# EasyEDA Pro project ChisFlash-MBC5_GBC烧录卡_shn修改plus图纸nds烧录线路+电池加固通孔.epro, board ChisFlash-MBC5-Plus-v1.1
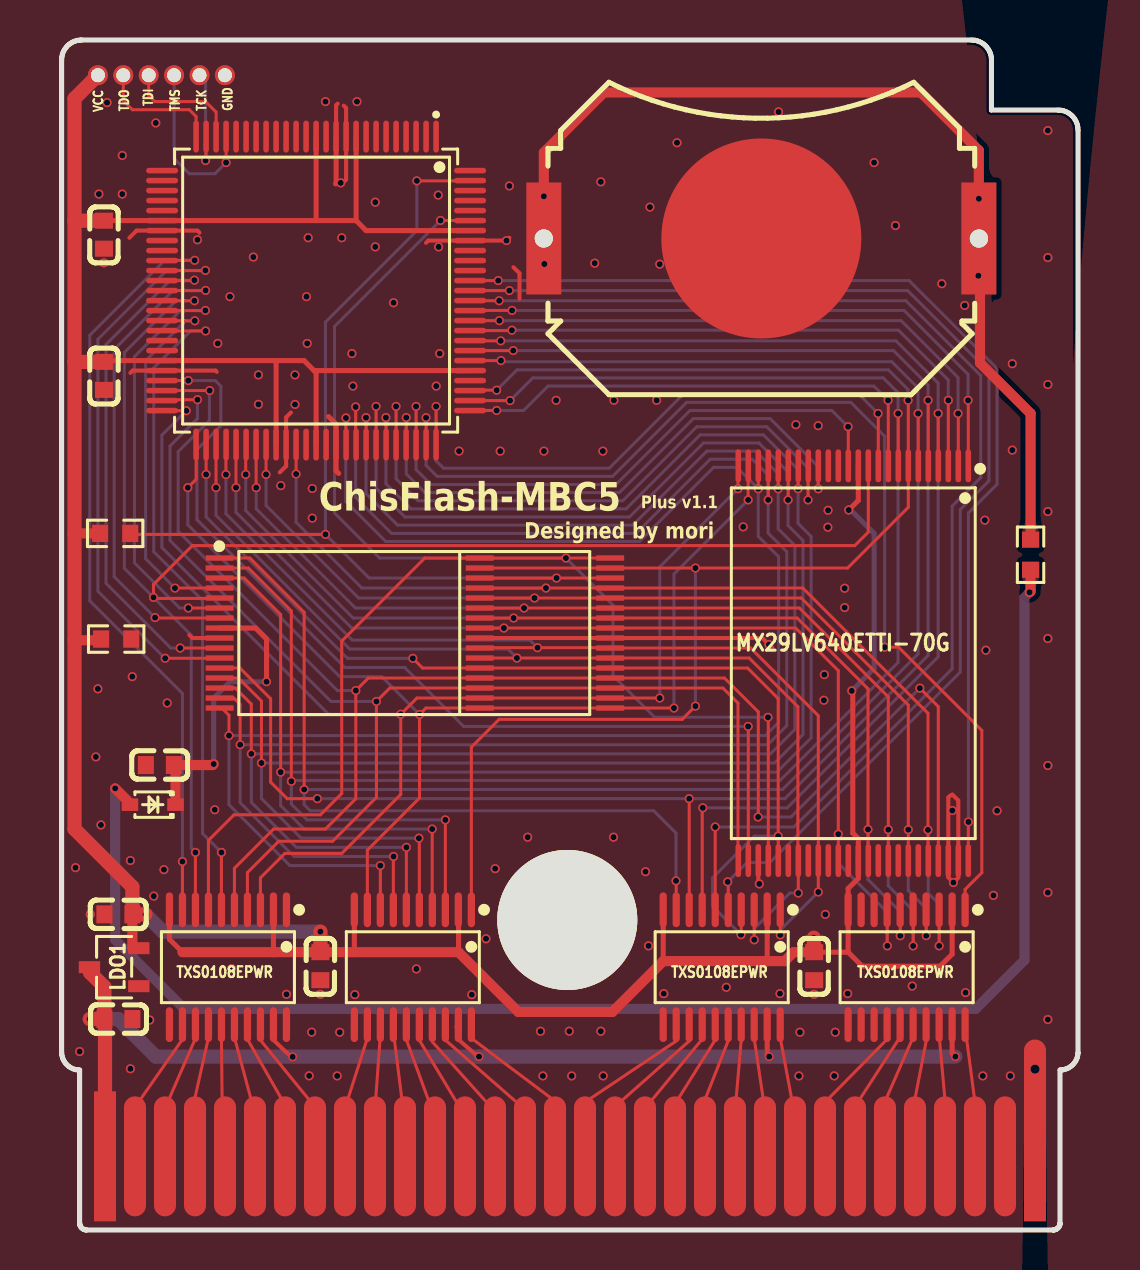
[diagram p4: board, top side]
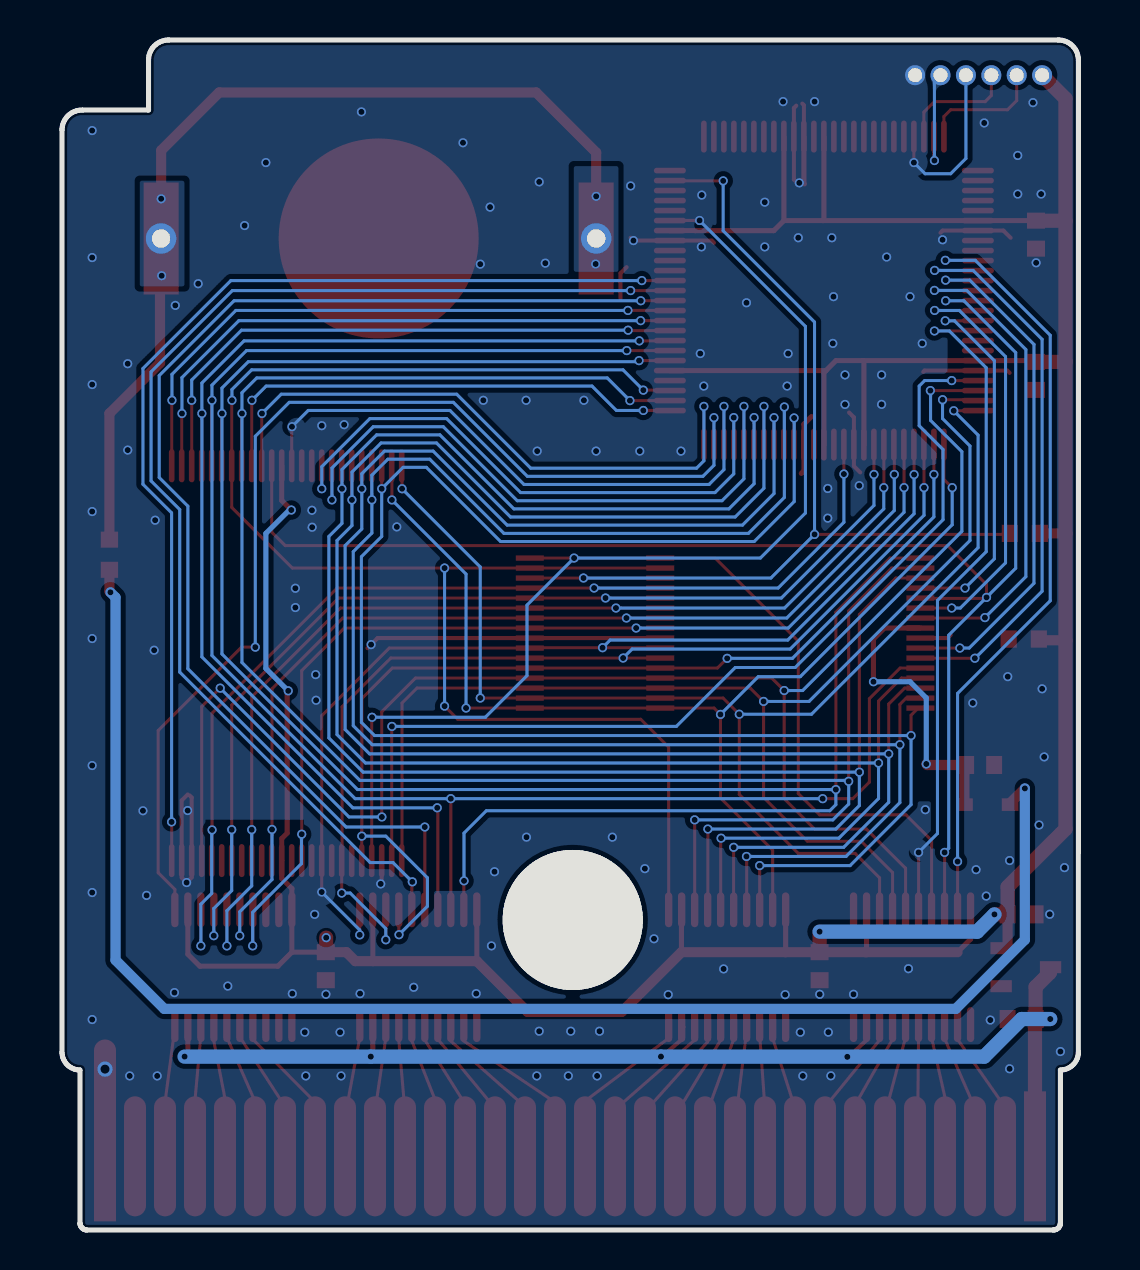
[diagram p5: board, bottom side, seen from below]

Outline 50.82 x 59.5 mm; copper layers: Top Layer, Bottom Layer. Coordinates in mm from the lower left corner of the outline.
Stack: Top Layer 0.035mm / Dielectric1 1.51mm FR4 er 4.5 / Bottom Layer 0.035mm

## Design rules (mm)
template: 自定义配置
spacing copperThickness1oz (default): track to track 0.254, other pairs 0.152 to 0.152
spacing copperThickness2oz: track to track 0.203, other pairs 0.152 to 0.3
track width copperThickness1oz (default): min 0.152, default 0.152, max 2.54
track width copperThickness2oz: min 0.203, default 0.254, max 2.54
differential pair differentialPair (default): width min 0.127, default 0.254, max 2.54; gap min 0.152, default 0.152
via viaSize (default): diameter min 0.457, default 0.457, max 10; hole min 0.3, default 0.305, max 6.299

## Placement (name value [footprint] x y rotation side)
BT1  MY-2016-02  [BAT-SMD_MY-2032-08]  34.99 49.58 180 top
C1  100nF  [C0603]  4.91 23.25 0 top
C3  100nF  [C0603]  2.12 49.77 90 top
C4  100nF  [C0603]  2.12 42.71 90 top
C5  10uF  [C0603]  2.84 10.55 180 top
C6  10uF  [C0603]  2.84 15.78 0 top
C7  100nF  [C0603]  12.94 13.19 90 top
C10  100nF  [C0603]  37.63 13.19 90 top
D1  RB751V-40  [SOD-323_L1.7-W1.3-LS2.6-RD-1]  4.56 21.27 180 top
J1  GAMEBOY-CARTRIDGE-MBC3  [GAMEBOY_CARTRIDGE_PIN]  25.28 15.5 0 top
LDO1  ME6209A33M3G  [SOT-23-3_L2.9-W1.6-P1.90-LS2.8-BR]  2.63 13.14 0 top
NOREF  -  [Pad_e0]  45.87 49.58 0 top
NOREF#2  -  [Pad_e2]  24.11 49.58 0 top
NOREF#3  -  [Pad_e20]  24.11 49.58 0 top
R1  10kΩ  [R0603]  48.45 33.77 270 top
R2  100kΩ  [R0603]  2.73 29.55 0 top
R3  10kΩ  [R0603]  2.68 34.83 180 top
U1  MX29LV640ETTI-70GTR  [TSOP-48_L12.0-W18.4-P0.50-LS20.0-BL]  39.58 28.34 180 top
U2  SRAM&FRAM  [TSSOP-TSOP二合一]  18.67 29.83 180 top
U3  EPM240T100C5N  [TQFP-100_L14.0-W14.0-P0.50-LS16.0-BL]  12.72 46.97 180 top
U7  TXS0108EPWR  [TSSOP-20_L6.5-W4.4-P0.65-LS6.4-BL]  8.32 13.14 180 top
U8  TXS0108EPWR  [TSSOP-20_L6.5-W4.4-P0.65-LS6.4-BL]  17.56 13.14 180 top
U9  TXS0108EPWR  [TSSOP-20_L6.5-W4.4-P0.65-LS6.4-BL]  33.01 13.14 180 top
U10  TXS0108EPWR  [TSSOP-20_L6.5-W4.4-P0.65-LS6.4-BL]  42.25 13.14 180 top
XP1  JTAG  [HDR-TH_6P-P1.27-V-M-1]  4.99 57.74 0 top

## Footprints (pads in the part's own frame, mm; a bottom-side part is the same pattern mirrored in y, then rotated)
BAT-SMD_MY-2032-08
  rect 1.75x5.6 smd: 1(-10.875,0) 1(10.875,0)
  round 10 smd: 2(0,0)
C0603
  rect 0.8x0.9 smd: 1(-0.7,0) 2(0.7,0)
GAMEBOY_CARTRIDGE_PIN
  round 7 hole 7: 0(0,0)
  rect 1.1x6.5 smd: 1(-23.114,-11.819) 32(23.386,-11.819)
  oval 1.1x6 smd: 2(-21.614,-11.819) 3(-20.114,-11.819) 4(-18.614,-11.819) 5(-17.114,-11.819) 6(-15.614,-11.819) 7(-14.114,-11.819) 8(-12.614,-11.819) 9(-11.114,-11.819) 10(-9.614,-11.819) 11(-8.114,-11.819) 12(-6.614,-11.819) 13(-5.114,-11.819) 14(-3.614,-11.819) 15(-2.114,-11.819) 16(-0.614,-11.819) 17(0.886,-11.819) 18(2.386,-11.819) 19(3.886,-11.819) 20(5.386,-11.819) 21(6.886,-11.819) 22(8.386,-11.819) 23(9.886,-11.819) 24(11.386,-11.819) 25(12.886,-11.819) 26(14.386,-11.819) 27(15.886,-11.819) 28(17.386,-11.819) 29(18.886,-11.819) 30(20.386,-11.819) 31(21.886,-11.819)
HDR-TH_6P-P1.27-V-M-1
  round 1 hole 0.7: 1(-3.175,0) 2(-1.905,0) 3(-0.635,0) 4(0.635,0) 5(1.905,0) 6(3.175,0)
Pad_e0
  round 1.524 hole 0.914: 1(0,0)
Pad_e2
  round 1.524 smd: 2(0,0)
Pad_e20
  round 1.524 hole 0.914: 1(0,0)
R0603
  rect 0.806x0.864 smd: 1(-0.753,0) 2(0.753,0)
SOD-323_L1.7-W1.3-LS2.6-RD-1
  rect 0.83x0.63 smd: 1(-1.14,0) 2(1.14,0)
SOT-23-3_L2.9-W1.6-P1.90-LS2.8-BR
  rect 1.07x0.6 smd: 1(1.235,-0.95) 2(1.235,0.95) 3(-1.235,0)
TQFP-100_L14.0-W14.0-P0.50-LS16.0-BL
  oval 0.28x1.6 smd: 1(-6,-7.7) 2(-5.5,-7.7) 3(-5,-7.7) 4(-4.5,-7.7) 5(-4,-7.7) 6(-3.5,-7.7) 7(-3,-7.7) 8(-2.5,-7.7) 9(-2,-7.7) 10(-1.5,-7.7) 11(-1,-7.7) 12(-0.5,-7.7) 13(0,-7.7) 14(0.5,-7.7) 15(1,-7.7) 16(1.5,-7.7) 17(2,-7.7) 18(2.5,-7.7) 19(3,-7.7) 20(3.5,-7.7) 21(4,-7.7) 22(4.5,-7.7) 23(5,-7.7) 24(5.5,-7.7) 25(6,-7.7) 51(6,7.7) 52(5.5,7.7) 53(5,7.7) 54(4.5,7.7) 55(4,7.7) 56(3.5,7.7) 57(3,7.7) 58(2.5,7.7) 59(2,7.7) 60(1.5,7.7) 61(1,7.7) 62(0.5,7.7) 63(0,7.7) 64(-0.5,7.7) 65(-1,7.7) 66(-1.5,7.7) 67(-2,7.7) 68(-2.5,7.7) 69(-3,7.7) 70(-3.5,7.7) 71(-4,7.7) 72(-4.5,7.7) 73(-5,7.7) 74(-5.5,7.7) 75(-6,7.7)
  oval 1.6x0.28 smd: 26(7.7,-6) 27(7.7,-5.5) 28(7.7,-5) 29(7.7,-4.5) 30(7.7,-4) 31(7.7,-3.5) 32(7.7,-3) 33(7.7,-2.5) 34(7.7,-2) 35(7.7,-1.5) 36(7.7,-1) 37(7.7,-0.5) 38(7.7,0) 39(7.7,0.5) 40(7.7,1) 41(7.7,1.5) 42(7.7,2) 43(7.7,2.5) 44(7.7,3) 45(7.7,3.5) 46(7.7,4) 47(7.7,4.5) 48(7.7,5) 49(7.7,5.5) 50(7.7,6) 76(-7.7,6) 77(-7.7,5.5) 78(-7.7,5) 79(-7.7,4.5) 80(-7.7,4) 81(-7.7,3.5) 82(-7.7,3) 83(-7.7,2.5) 84(-7.7,2) 85(-7.7,1.5) 86(-7.7,1) 87(-7.7,0.5) 88(-7.7,0) 89(-7.7,-0.5) 90(-7.7,-1) 91(-7.7,-1.5) 92(-7.7,-2) 93(-7.7,-2.5) 94(-7.7,-3) 95(-7.7,-3.5) 96(-7.7,-4) 97(-7.7,-4.5) 98(-7.7,-5) 99(-7.7,-5.5) 100(-7.7,-6)
TSOP-48_L12.0-W18.4-P0.50-LS20.0-BL
  oval 0.28x1.65 smd: 1(-5.75,-9.87) 2(-5.25,-9.87) 3(-4.75,-9.87) 4(-4.25,-9.87) 5(-3.75,-9.87) 6(-3.25,-9.87) 7(-2.75,-9.87) 8(-2.25,-9.87) 9(-1.75,-9.87) 10(-1.25,-9.87) 11(-0.75,-9.87) 12(-0.25,-9.87) 13(0.25,-9.87) 14(0.75,-9.87) 15(1.25,-9.87) 16(1.75,-9.87) 17(2.25,-9.87) 18(2.75,-9.87) 19(3.25,-9.87) 20(3.75,-9.87) 21(4.25,-9.87) 22(4.75,-9.87) 23(5.25,-9.87) 24(5.75,-9.87) 25(5.75,9.87) 26(5.25,9.87) 27(4.75,9.87) 28(4.25,9.87) 29(3.75,9.87) 30(3.25,9.87) 31(2.75,9.87) 32(2.25,9.87) 33(1.75,9.87) 34(1.25,9.87) 35(0.75,9.87) 36(0.25,9.87) 37(-0.25,9.87) 38(-0.75,9.87) 39(-1.25,9.87) 40(-1.75,9.87) 41(-2.25,9.87) 42(-2.75,9.87) 43(-3.25,9.87) 44(-3.75,9.87) 45(-4.25,9.87) 46(-4.75,9.87) 47(-5.25,9.87) 48(-5.75,9.87)
TSSOP-20_L6.5-W4.4-P0.65-LS6.4-BL
  oval 0.364x1.742 smd: 1(-2.925,-2.871) 2(-2.275,-2.871) 3(-1.625,-2.871) 4(-0.975,-2.871) 5(-0.325,-2.871) 6(0.325,-2.871) 7(0.975,-2.871) 8(1.625,-2.871) 9(2.275,-2.871) 10(2.925,-2.871) 11(2.925,2.871) 12(2.275,2.871) 13(1.625,2.871) 14(0.975,2.871) 15(0.325,2.871) 16(-0.325,2.871) 17(-0.975,2.871) 18(-1.625,2.871) 19(-2.275,2.871) 20(-2.925,2.871)
TSSOP-TSOP二合一
  rect 1.399x0.27 smd: 1(10.762,-3.769) 2(10.762,-3.269) 3(10.762,-2.769) 4(10.762,-2.269) 5(10.762,-1.769) 6(10.762,-1.269) 7(10.762,-0.769) 8(10.762,-0.269) 9(10.762,0.231) 10(10.762,0.731) 11(10.762,1.231) 12(10.762,1.731) 13(10.762,2.231) 14(10.762,2.731) 15(10.762,3.231) 16(10.762,3.731) 17(-8.763,3.731) 17(-2.243,3.731) 18(-8.763,3.231) 18(-2.243,3.231) 19(-8.763,2.731) 19(-2.243,2.731) 20(-8.763,2.231) 20(-2.243,2.231) 21(-8.763,1.731) 21(-2.243,1.731) 22(-8.763,1.231) 22(-2.243,1.231) 23(-8.763,0.731) 23(-2.243,0.731) 24(-8.763,0.231) 24(-2.243,0.231) 25(-8.763,-0.269) 25(-2.243,-0.269) 26(-8.763,-0.769) 26(-2.243,-0.769) 27(-8.763,-1.269) 27(-2.243,-1.269) 28(-8.763,-1.769) 28(-2.243,-1.769) 29(-8.763,-2.269) 29(-2.243,-2.269) 30(-8.763,-2.769) 30(-2.243,-2.769) 31(-8.763,-3.269) 31(-2.243,-3.269) 32(-8.763,-3.769) 32(-2.243,-3.769)

## Nets
As in the schematic, except:
BAT+: BT1.1 NOREF.1 NOREF#2.2 NOREF#3.1 R1.1

Pads without a net: J1 0 31; U1 14 15 30 32 34 36 39 41 43; U3 1 2 3 4 5 6 7 8 12 14 15 16 17 18 19 20 21 26 27 28 29 30 33 34 43 44 62 64 90 91 92 96 97 98 100; U7 1 20; U10 8 9 12 13

## Via types
v1: diameter 0.457, hole 0.305, Top Layer to Bottom Layer, 281 vias
v2: diameter 0.762, hole 0.457, Top Layer to Bottom Layer, 1 via
v3: diameter 0.508, hole 0.305, Top Layer to Bottom Layer, 2 vias

## Routing (per net, layer and track width the routed paths; a pad name or vN(x,y) marks a point on that pad's centre or on a via; arc(x,y) is an arc through that point)
+3V3: length 199.6
  Top Layer w0.254: 6.04,13.89 5.39,14.54 U7.10 ; U3.63 12.72,42.87 12.62,42.97 ; C3.2 2.13,50.47 U3.31 12.76,50.47 ; 12.62,42.97 U3.80 ; 12.62,42.97 12.12,43.47 10.76,43.47 ; 10.62,13.89 10.59,13.92 U7.2 ; 10.76,43.47 10.72,43.43 U3.59 ; 10.76,43.47 U3.45 2.19,43.47 C4.2 ; U8.2 19.85,16 19.85,13.89 ; 30.08,13.45 U9.10 ; U3.94 19.16,49.97 19.15,49.97 15.23,49.97 14.72,50.47 ; 12.76,50.47 12.72,50.51 U3.13 ; 12.76,50.47 14.72,50.47 ; U3.9 14.72,50.47 ; v1(39.51,26.96) 39.56,26.91 39.56,19.85 39.83,19.57 U1.37 39.83,17.58 39.33,17.07 U10.10 39.33,13.89 ; C10.2 39.33,13.89 ; 39.33,13.89 40.03,13.19 43.93,13.19 44.53,13.79 U10.2 ; 14.64,13.89 U8.10 ; U1.12 39.83,36.48 v1(39.36,36) ; U9.2 35.28,13.45
  Top Layer w0.508: LDO1.2 3.54,14.09 C6.2 ; R3.2 0.65,34.83 ; C10.2 36.6,13.89 36.16,13.45 30.08,13.45 27.54,10.91 22.83,10.91 19.85,13.89 C7.2 6.04,13.89 ; 1.91,29.49 0.65,29.49
  Top Layer w0.711: 0.65,50.45 0.66,50.47 C3.2 ; 0.65,50.45 0.65,56.57 XP1.1 ; 0.65,50.45 0.65,43.42 ; C4.2 0.66,43.41 0.65,43.42 ; v3(4.2,15.78) C6.2 3.54,17.16 0.65,20.05 0.65,43.42 ; v1(37.61,14.62) 37.61,13.91 C10.2 ; C7.2 v1(12.94,14.92)
  Bottom Layer w0.254: v1(39.36,36) 39.46,36 40.63,34.83 40.63,28.08 v1(39.51,26.96)
  Bottom Layer w0.711: v1(12.94,14.92) 5.06,14.92 v3(4.2,15.78)
+5V: length 61.2
  Top Layer w0.203: 11.51,8.62 10.58,9.51 ; U8.19 19.83,10.27 19.75,10.16 19.86,9.5 20.69,8.78 20.76,8.78 v1(20.87,8.67)
  Top Layer w0.254: v1(44.69,8.67) 44.53,8.83 U10.19 ; v1(35.38,8.67) 35.28,8.77 U9.19
  Top Layer w0.711: 1.4,13.05 1.43,13.02 1.43,12.87 2.14,12.15 C5.2 v3(1.41,10.55) ; J1.1 2.17,10.52
  Bottom Layer w0.711: v3(1.41,10.55) 2.83,10.55 4.71,8.67 v1(20.87,8.67) v1(35.38,8.67) v1(44.69,8.67)
  vias: v1(11.55,8.66)
GND: length 60.4
  Top Layer w0.203: 10.91,37.88 11.22,38.2 U3.60 11.22,40.64 11.47,40.88 ; 6.89,49.87 6.79,49.97 U3.32 3.75,49.97 3.39,49.61 ; 13.8,56.32 13.72,56.24 U3.11 ; U2.9 6.54,29.6 6.39,29.75 ; U1.27 34.83,17.36 v1(34.88,17.31) ; 7.76,42.91 7.69,42.97 U3.46 3.55,42.97 3.44,42.86 ; U2.24 35.04,29.6 v1(35.37,29.27) 35.55,29.09 ; 44.44,21.73 44.33,21.62 U1.46 44.33,17.63 v1(44.59,17.37) 44.83,17.62 U1.47 44.83,21.48 44.54,21.78 ; 14.06,52.36 14.22,52.53 U3.10 14.22,56.1 14.11,56.22 ; 22.59,48.14 22.9,47.84 22.9,46.57 ; 22.39,49.61 v1(22.25,49.47) U3.93 18.34,49.47 18.22,49.36
  Top Layer w0.254: 13.35,40.67 13.72,40.29 U3.65 13.72,37.96 13.85,37.83 ; U3.11 13.72,52.33 13.7,52.31
  Top Layer w1.1: 48.67,8.97 v2(48.67,8.04) J1.32
  vias: v1(0.7,18.12) v1(0.9,8.92) v1(1.43,15.79) v1(1.71,23.66) v1(1.81,27.06) v1(1.86,51.8) v1(1.97,20.25) v1(2.11,48.36) v1(2.27,56.37) v1(3.03,53.73) v1(3.03,51.8) v1(3.53,27.67) v1(3.44,18.47) v1(3.44,8.06) v1(4.41,10.5) v1(4.61,16.7) v1(4.71,55.36) v1(5.12,18.02) v1(5.28,26.35) v1(6.79,49.51) v1(7.66,21.01) v1(7.81,44.33) v1(8.42,46.67) v1(8.5,13.07) v1(9.59,48.65) v1(9.84,42.76) v1(9.84,41.28) v1(10.96,37.22) v1(11.25,11.79) v1(11.67,42.76) v1(11.67,41.28) v1(12.33,49.61) v1(12.25,46.67) v1(12.28,44.33) v1(12.38,7.71) v1(12.53,37.08) v1(12.53,35.59) v1(12.5,9.89) v1(12.93,11.79) v1(13.19,56.42) v1(13.78,7.7) v1(13.91,9.89) v1(13.96,52.36) v1(14.01,49.61) v1(14.51,43.82) v1(14.56,42.2) v1(14.66,11.77) v1(14.77,56.42) v1(15.68,51.39) v1(15.68,49.16) v1(16.6,46.36) v1(17.74,13.05) v1(18.73,42.2) v1(18.83,51.75) v1(18.85,49.16) v1(18.91,43.82) v1(19.87,38.95) v1(20.51,11.77) v1(21.22,14.56) v1(21.68,18.07) v1(21.93,38.95) v1(22.39,52.21) v1(23.3,19.64) v1(23.94,9.94) v1(24.12,38.95) v1(24.06,7.7) v1(24.72,41.49) v1(25.38,9.94) v1(25.5,7.7) v1(26.66,48.34) v1(26.96,52.41) v1(26.96,9.94) v1(27.06,38.95) v1(27.08,7.7) v1(27.62,41.49) v1(27.6,19.64) v1(29.2,17.92) v1(29.42,51.15) v1(29.35,14.21) v1(29.75,41.49) v1(29.91,48.29) v1(30.11,11.82) v1(30.77,54.37) v1(33.23,12.14) v1(34.08,35.16) v1(35.85,55.91) v1(35.92,11.82) v1(36.71,40.27) v1(36.92,9.89) v1(36.87,7.7) v1(37.62,11.79) v1(37.83,40.22) v1(38.12,26.49) v1(38.14,27.77) v1(38.19,15.78) v1(38.32,35.99) v1(38.31,35.14) v1(38.63,7.7) v1(38.68,9.89) v1(39.15,32.09) v1(39.15,31.12) v1(39.3,11.82) v1(40.63,53.37) v1(41.69,50.22) v1(42.53,12.2) v1(44.01,47.32) v1(44.54,20.97) v1(45.16,46.23) v1(45.2,11.87) v1(46.06,7.7) v1(46.16,35.49) v1(46.21,28.99) v1(46.59,16.73) v1(46.77,20.96) v1(47.44,7.7) v1(47.53,43.32) v1(47.53,39) v1(49.31,54.97) v1(49.31,48.62) v1(49.31,42.27) v1(49.31,35.92) v1(49.31,29.57) v1(49.31,23.22) v1(49.31,16.87) v1(49.31,10.52)
A0: length 83.3
  Top Layer w0.152: v1(42.91,27.1) 43.83,26.17 43.83,18.64 ; U3.48 v1(7.4,41.97) ; v1(34.83,20.65) 34.83,20.66 34.83,25.91 33.14,27.6 15.34,27.6 v1(14.71,26.98) 14.71,21.57 13.19,20.05 10.6,20.05 8.64,18.09 U7.5
  Bottom Layer w0.152: v1(34.83,20.65) 36.47,20.65 v1(42.91,27.1) ; v1(14.71,26.98) 13.79,26.98 5.83,34.93 5.83,38.92 7.39,40.48 7.39,42.06
A0_EXT: length 3.7
  Top Layer w0.152: 9.62,5.99 8.65,9.61
A1: length 64.1
  Top Layer w0.152: v1(6.79,41.52) 5.07,41.52 U3.49 ; U7.4 9.29,17.87 10.86,19.44 13.55,19.44 15.74,21.63 v1(15.74,26.43) 16.41,27.1 33.07,27.1 33.82,26.35 33.82,18.65 33.83,18.64
  Bottom Layer w0.152: v1(6.79,41.52) 6.79,40.57 5.42,39.2 5.42,34.48 13.47,26.43 v1(15.74,26.43)
A1_EXT: length 3.9
  Top Layer w0.152: 11.2,6.19 9.29,9.54
A2: length 65
  Top Layer w0.152: v1(33.82,37.06) 33.82,38.36 33.83,38.38 ; v1(6.23,40.97) 5.03,40.97 U3.50 ; U7.3 9.94,17.61 11.16,18.83 14.01,18.83 16.96,21.78 v1(16.96,25.79) 17.77,26.6 v1(29.91,26.6)
  Bottom Layer w0.152: v1(16.96,25.79) 13.35,25.79 5.01,34.12 5.01,39.75 v1(6.23,40.97) ; v1(33.82,37.06) 29.91,33.15 v1(29.91,26.6)
A2_EXT: length 4.4
  Top Layer w0.152: 12.68,6.14 9.92,9.52
A3: length 57.2
  Top Layer w0.152: 34.33,38.38 34.33,38.37 v1(34.33,36.51) ; v1(30.62,26.1) 18.22,26.1 v1(17.9,25.78) 17.9,21.6 15.29,18.99 U8.9 ; v1(6.31,37.12) 6.72,37.53 U3.51
  Bottom Layer w0.152: v1(6.31,37.12) 6.31,35.26 13.91,27.67 16.01,27.67 v1(17.9,25.78) ; v1(34.33,36.51) 30.62,32.8 v1(30.62,26.1)
A3_EXT: length 3.3
  Top Layer w0.152: 14.24,6.3 15.25,9.48
A4: length 86.1
  Top Layer w0.152: v1(14.22,40.6) 14.22,39.28 U3.66 ; v1(34.83,37.06) 34.83,38.38 ; 8.01,26.1 8.37,25.74 v1(8.37,24.72) ; v1(15.94,18.22) U8.8
  Bottom Layer w0.152: v1(14.22,40.6) 14.21,40.6 14.21,36.43 16.21,34.43 28.89,34.43 32.6,38.13 33.76,38.13 v1(34.83,37.06) 34.83,34.68 35.85,33.66 35.85,25.38 35.19,24.72 v1(8.37,24.72) 8.37,21.27 11.42,18.22 v1(15.94,18.22)
A4_EXT: length 3.6
  Top Layer w0.152: 15.66,5.97 15.92,9.56
A5: length 89.7
  Top Layer w0.152: v1(8.93,24.27) 8.93,26.28 8.61,26.6 U2.15 ; v1(35.33,36.51) 35.33,36.52 35.33,38.38 ; U3.67 14.7,39.3 v1(14.7,41.15) ; v1(16.6,18.68) 16.59,18.67 U8.7
  Bottom Layer w0.152: v1(14.7,41.15) 14.7,36.63 16.5,34.83 28.72,34.83 32.43,38.54 34.53,38.54 35.33,37.74 v1(35.33,36.51) 35.33,34.85 36.26,33.92 36.26,25.22 35.31,24.27 v1(8.93,24.27) 8.93,21.37 11.62,18.68 v1(16.6,18.68)
A5_EXT: length 3.9
  Top Layer w0.152: 17.12,5.66 16.64,9.54
A6: length 89.6
  Top Layer w0.152: v1(9.48,23.81) 9.48,26.3 8.68,27.1 7.5,27.1 ; 35.83,38.38 35.83,37.07 v1(35.83,37.06) ; U8.6 17.24,16.01 v1(17.24,19.13) ; v1(15.22,40.62) 15.22,40.61 U3.68
  Bottom Layer w0.152: v1(17.24,19.13) 11.74,19.13 9.48,21.39 v1(9.48,23.81) 35.44,23.81 36.66,25.03 36.66,34.22 35.83,35.06 v1(35.83,37.06) 35.83,37.81 34.7,38.95 32.26,38.95 28.56,35.25 16.8,35.25 15.22,36.82 v1(15.22,40.62)
A6_EXT: length 3.4
  Top Layer w0.152: 17.22,9.57 18.38,6.38
A7: length 92.4
  Top Layer w0.152: 7.5,27.6 8.84,27.6 9.99,26.45 v1(9.99,23.35) ; v1(17.87,19.59) 17.89,19.57 U8.5 ; 36.33,38.38 36.33,36.52 v1(36.32,36.51) ; 15.72,41.18 U3.69
  Bottom Layer w0.152: v1(15.72,41.18) 15.72,37.09 17.16,35.65 28.39,35.65 32.09,39.35 34.87,39.35 36.32,37.9 v1(36.32,36.51) 36.32,35.22 37.07,34.48 37.07,24.77 35.65,23.35 v1(9.99,23.35) 9.99,21.57 11.97,19.59 v1(17.87,19.59)
A7_EXT: length 4
  Top Layer w0.152: 17.92,9.57 17.9,9.48 19.83,6.26 19.93,6.23
A8: length 95.6
  Top Layer w0.152: 36.83,38.38 36.82,38.37 v1(36.82,37.06) ; v1(10.95,22.89) 10.95,30.77 9.13,32.6 8.06,32.6 ; v1(18.53,20.05) 18.53,16.02 U8.4 ; v1(16.22,40.62) 16.22,40.61 U3.70
  Bottom Layer w0.152: v1(16.22,40.62) 16.22,37.32 17.47,36.06 28.23,36.06 31.93,39.76 35.09,39.76 36.82,38.03 v1(36.82,37.06) 36.82,35.33 37.48,34.68 37.48,24.61 35.76,22.89 v1(10.95,22.89) 10.95,21.22 12.13,20.05 v1(18.53,20.05)
A8_EXT: length 4.5
  Top Layer w0.152: 18.55,9.55 18.54,9.4 21.32,6.31 21.47,6.3
A9: length 97.4
  Top Layer w0.152: v1(41.82,40.83) 41.83,40.82 41.83,38.38 ; v1(22.42,41.47) 20.43,41.47 ; v1(19.19,20.51) U8.3 ; 8.06,33.1 9.34,33.1 11.49,30.95 v1(11.49,22.44)
  Bottom Layer w0.152: v1(22.42,41.47) 23.56,42.6 41.08,42.6 41.82,41.86 v1(41.82,40.83) 41.82,28.38 35.93,22.48 11.53,22.48 v1(11.49,22.44) 11.49,21.3 12.28,20.51 v1(19.19,20.51)
A9_EXT: length 4.9
  Top Layer w0.152: 19.23,9.54 19.23,9.46 22.81,6.33 22.9,6.34
A10: length 78.3
  Top Layer w0.152: v1(31.69,26.2) 31.03,25.54 21.88,25.54 20.49,24.14 U8.1 ; 21.06,33.1 v1(31.69,33.1) 39.3,33.1 42.33,36.13 U1.7 42.33,41.48 v1(42.32,41.49) ; U3.78 20.45,41.99 v1(21.75,41.99)
  Bottom Layer w0.152: v1(31.69,33.1) v1(31.69,26.2) ; v1(42.32,41.49) 42.32,42.02 41.34,43.01 22.77,43.01 v1(21.75,41.99)
A10_EXT: length 5.1
  Top Layer w0.152: 20.55,9.54 24.63,6.47
A11: length 110.1
  Top Layer w0.152: v1(42.82,40.83) 42.83,40.82 42.83,38.38 ; v1(30.72,17.46) 30.73,17.45 U9.9 ; v1(21.97,43.47) 20.43,43.47 U3.81 ; 8.06,33.6 9.41,33.6 12.13,30.89 v1(12.13,22.02)
  Bottom Layer w0.152: v1(21.97,43.47) 22.02,43.42 41.5,43.42 42.82,42.1 v1(42.82,40.83) 42.82,28.8 36.04,22.02 v1(12.13,22.02) 12.13,21.27 12.43,20.96 29.6,20.96 30.72,19.85 v1(30.72,17.46)
A11_EXT: length 5.3
  Top Layer w0.152: 26.37,6.53 30.75,9.46
A12: length 89.2
  Top Layer w0.152: 8,28.1 8.92,28.1 10.45,26.57 10.45,22.4 11.28,21.57 v1(12.79,21.57) ; v1(31.38,21.57) U9.8 ; v1(22.58,43.97) 20.43,43.97 ; 43.33,38.38 43.33,41.48 v1(43.32,41.49)
  Bottom Layer w0.152: v1(22.58,43.97) 41.59,43.97 43.32,42.24 v1(43.32,41.49) 43.32,28.73 36.16,21.57 v1(31.38,21.57) v1(12.79,21.57)
A12_EXT: length 4.5
  Top Layer w0.152: 31.4,9.47 28.01,6.47
A13: length 60.4
  Top Layer w0.152: v1(21.96,44.46) 20.44,44.46 U3.83 ; v1(32.06,21.11) 32.03,21.08 U9.7 ; v1(43.83,40.83) 43.83,38.39 43.83,38.38
  Bottom Layer w0.152: v1(32.06,21.11) 36.28,21.11 43.83,28.66 v1(43.83,40.83) 43.83,42.35 41.72,44.46 v1(21.96,44.46)
A13_EXT: length 4.1
  Top Layer w0.152: 32.07,9.6 29.49,6.47
A14: length 61.6
  Top Layer w0.152: v1(21.88,46.47) 20.43,46.47 U3.87 ; U9.6 v1(32.68,20.15)
  Bottom Layer w0.152: v1(21.88,46.47) 42.22,46.47 45.96,42.72 45.96,37.63 44.53,36.19 44.53,28.07 36.61,20.15 v1(32.68,20.15)
A14_EXT: length 3.6
  Top Layer w0.152: 32.71,9.55 30.8,6.51
A15: length 60.6
  Top Layer w0.152: v1(33.3,17.41) 33.33,17.38 U9.5 ; U3.88 v1(22.39,46.97)
  Bottom Layer w0.152: v1(33.3,17.41) 34.27,18.37 35.41,18.37 44.93,27.9 44.93,36.03 46.37,37.46 46.37,42.91 42.3,46.97 v1(22.39,46.97)
A15_EXT: length 3.3
  Top Layer w0.152: 33.35,9.51 32.15,6.48
BAT+: length 48.4
  Top Layer w0.508: R1.1 48.45,40.83 45.92,43.36 45.92,49.01 ; BT1.1 v1(45.86,51.56) 45.86,53.98 42.96,56.88 27.11,56.88 24.11,53.88 v1(24.11,51.69) BT1.1
  vias: v1(24.14,48.3) v1(45.84,47.72)
BATQ1: length 76.2
  Top Layer w0.508: v1(2.68,22.08) 3.42,21.34 D1.2 ; R1.2 48.45,31.94 v1(48.4,31.89)
  Bottom Layer w0.508: v1(48.4,31.89) 48.14,31.63 48.14,13.5 45.71,11.06 6.13,11.06 2.68,14.51 v1(2.68,22.08)
CE2: length 22.2
  Top Layer w0.152: U3.40 7.19,45.97 v1(7.19,45.98) ; v1(6.34,31.1) U2.6
  Bottom Layer w0.152: v1(7.19,45.98) 5.95,45.98 3.64,43.67 3.64,33.36 5.9,31.1 v1(6.34,31.1)
CLK: length 39.1
  Top Layer w0.152: v1(6.65,48.49) 4.98,48.49 4.97,48.5 ; U7.9 v1(6.04,18.42)
  Bottom Layer w0.152: v1(6.65,48.49) 5.16,48.49 1.41,44.74 1.41,31.46 6.04,26.83 v1(6.04,18.42)
CLK_EXT: length 4.2
  Top Layer w0.152: 3.69,6.17 6.07,9.57
CS: length 34
  Top Layer w0.152: v1(7.2,44.95) 5.04,44.95 U3.42 ; U7.6 v1(7.99,18.88)
  Bottom Layer w0.152: v1(7.2,44.95) 6.45,44.95 4.61,43.11 4.61,33.92 7.05,31.48 7.05,19.83 v1(7.99,18.88)
CS_EXT: length 3.8
  Top Layer w0.152: 8.03,5.94 7.99,9.73
D0: length 52.9
  Top Layer w0.152: U9.4 33.98,14.78 v1(33.97,14.77) ; v1(17.56,28.58) 18.05,28.1 34.3,28.1 35.83,26.57 35.83,26.56 v1(35.83,19.69) 35.83,19.69 U1.29 ; U3.52 v1(7.22,37.78)
  Bottom Layer w0.152: v1(7.22,37.78) 7.22,35.66 14.3,28.58 v1(17.56,28.58) ; v1(33.97,14.77) 32.55,16.19 32.55,17.61 34.63,19.69 v1(35.83,19.69)
D0_EXT: length 3.5
  Top Layer w0.152: 33.99,9.57 33.68,6.05
D1: length 52.8
  Top Layer w0.152: v1(36.83,16.85) 36.83,18.64 36.82,18.66 36.82,26.16 34.38,28.6 U2.22 v1(22.76,28.6) U2.22 ; v1(7.72,37.12) 7.72,39.27 U3.53 ; v1(34.63,14.51) 34.63,16.01
  Bottom Layer w0.152: v1(22.76,28.6) 22.32,29.05 14.41,29.05 7.72,35.74 v1(7.72,37.12) ; v1(34.63,14.51) 34.63,15.07 36.41,16.85 v1(36.83,16.85)
D1_EXT: length 3.4
  Top Layer w0.152: 34.63,9.58 35.14,6.18
D2: length 53.2
  Top Layer w0.152: U9.1 35.93,16.01 v1(35.93,14.76) ; U2.23 20.92,29.12 v1(23.79,29.12) 27.41,29.12 U2.23 34.45,29.1 37.83,25.72 U1.33 v1(37.83,16.9) ; U3.54 8.22,39.26 v1(8.22,37.77)
  Bottom Layer w0.152: v1(23.79,29.12) 23.41,29.5 14.53,29.5 8.22,35.82 v1(8.22,37.77) ; v1(37.83,16.9) 35.93,15 v1(35.93,14.76)
D2_EXT: length 3.4
  Top Layer w0.152: 35.94,9.58 36.56,6.25
D3: length 55.6
  Top Layer w0.152: 21.06,30.1 v1(22.11,30.1) 36.71,30.1 38.83,27.97 v1(38.83,19.79) 38.83,18.64 ; U10.7 41.28,14.22 v1(41.29,14.21) ; U3.55 8.72,39.27 v1(8.72,37.12)
  Bottom Layer w0.152: v1(41.29,14.21) 41.29,15.88 38.85,18.32 38.85,19.78 v1(38.83,19.79) ; v1(22.11,30.1) 14.51,30.1 8.72,35.89 v1(8.72,37.12)
D3_EXT: length 4.4
  Top Layer w0.152: 41.35,9.61 38.27,6.5
D4: length 55.4
  Top Layer w0.152: v1(41.93,14.71) 41.93,16 U10.6 ; U3.56 9.21,39.25 v1(9.21,37.78) ; 40.33,18.64 40.32,18.65 v1(40.32,20.03) 40.32,27.06 36.78,30.6 v1(22.6,30.6) 21.06,30.6
  Bottom Layer w0.152: v1(22.6,30.6) 14.58,30.6 9.21,35.98 v1(9.21,37.78) ; v1(41.93,14.71) 41.93,15.91 40.32,17.52 v1(40.32,20.03)
D4_EXT: length 4.1
  Top Layer w0.152: 39.67,6.16 41.92,9.64
D5: length 56.9
  Top Layer w0.152: v1(42.58,14.2) U10.5 ; U3.57 9.72,37.12 v1(9.73,37.12) ; 21.06,31.1 v1(23.12,31.1) 36.89,31.1 41.33,26.66 v1(41.33,20.02) 41.33,18.64
  Bottom Layer w0.152: v1(9.73,37.12) 9.73,36.06 14.69,31.1 v1(23.12,31.1) ; v1(42.58,14.2) 42.58,15.97 41.33,17.21 v1(41.33,20.02)
D5_EXT: length 3.5
  Top Layer w0.152: 42.58,9.64 41.16,6.39
D6: length 56.5
  Top Layer w0.152: U3.58 10.22,39.27 v1(10.22,37.78) ; U10.4 43.23,14.72 v1(43.23,14.72) ; 42.33,18.64 v1(42.33,20.02) 42.33,26.25 36.98,31.6 v1(23.64,31.6) 21.06,31.6
  Bottom Layer w0.152: v1(42.33,20.02) 42.33,16.97 43.23,16.07 v1(43.23,14.72) ; v1(10.22,37.78) 10.22,36.23 14.85,31.6 v1(23.64,31.6)
D6_EXT: length 3.3
  Top Layer w0.152: 43.28,9.68 42.64,6.44
D7: length 57.6
  Top Layer w0.152: U3.61 v1(11.72,37.8) ; 21.06,32.1 v1(24.22,32.1) 37.06,32.1 43.32,25.84 v1(43.32,20.01) 43.32,18.65 43.33,18.64 ; v1(43.88,14.21) U10.3
  Bottom Layer w0.152: v1(11.72,37.8) 11.72,35.39 15.01,32.1 v1(24.22,32.1) ; v1(43.88,14.21) 43.88,16.29 43.33,16.83 43.33,19.99 v1(43.32,20.01)
D7_EXT: length 3.1
  Top Layer w0.152: 43.88,9.66 44.16,6.56
RAM_A13: length 19.1
  Top Layer w0.152: v1(5.67,32.1) 5.67,32.1 U2.4 ; v1(6.66,45.46) 5.04,45.46 U3.41
  Bottom Layer w0.152: v1(5.67,32.1) 4.2,33.56 4.2,43.47 6.2,45.46 v1(6.66,45.46)
RAM_A14: length 28.8
  Top Layer w0.152: v1(5.18,28.59) 7.61,28.59 7.62,28.6 ; v1(7.19,47.98) 7.18,47.97 U3.36 5.01,47.97
  Bottom Layer w0.152: v1(7.19,47.98) 5.26,47.98 1.81,44.53 1.81,31.94 5.17,28.59 v1(5.18,28.59)
RAM_A15: length 25.5
  Top Layer w0.152: U3.38 7.19,46.97 v1(7.2,46.98) ; U2.7 4.7,30.6 v1(4.67,30.62)
  Bottom Layer w0.152: v1(7.2,46.98) 5.58,46.98 2.63,44.03 2.63,32.67 v1(4.67,30.62)
RAM_A16: length 26.3
  Top Layer w0.152: U2.10 v1(5.93,29.1) ; v1(6.64,47.49) 6.62,47.47 U3.37
  Bottom Layer w0.152: v1(5.93,29.1) 5.46,29.1 2.22,32.34 2.22,44.28 5.43,47.49 v1(6.64,47.49)
RAM_CS: length 50.8
  Top Layer w0.152: R3.1 3.48,34.78 v1(13.19,34.78) ; 21.06,32.6 v1(24.75,32.6) U2.30 ; v1(17.76,52.46) 20.41,52.46 U3.99
  Bottom Layer w0.152: v1(17.76,52.46) 17.76,49.97 13.19,45.4 v1(13.19,34.78) 15.38,32.6 v1(24.75,32.6)
RD: length 87.1
  Top Layer w0.152: v1(35.32,25.64) 35.33,25.62 35.33,18.64 ; U3.95 20.42,50.48 v1(18.94,50.48) ; U7.7 7.34,19.48 8.62,20.76 12.94,20.76 14.01,21.83 14.01,29.45 18.16,33.6 v1(25.22,33.6) U2.32
  Bottom Layer w0.152: v1(35.32,25.64) 29.65,25.64 27.57,27.72 27.57,31.25 v1(25.22,33.6) 15.9,33.6 13.65,35.85 13.65,45.18 v1(18.94,50.48)
RD_EXT: length 3.7
  Top Layer w0.152: 6.56,6.12 7.36,9.7
ROM_A14: length 29.1
  Top Layer w0.152: 44.33,38.38 v1(44.33,41.49) ; U3.84 22.5,44.97 v1(22.52,44.99)
  Bottom Layer w0.152: v1(44.33,41.49) 44.33,42.5 41.84,44.99 v1(22.52,44.99)
ROM_A15: length 29.8
  Top Layer w0.152: v1(21.89,45.47) 20.43,45.47 U3.85 ; 44.83,38.38 44.83,40.82 v1(44.82,40.83)
  Bottom Layer w0.152: v1(44.82,40.83) 44.82,42.62 41.98,45.47 v1(21.89,45.47)
ROM_A16: length 30.6
  Top Layer w0.152: v1(45.32,41.49) 45.33,41.48 45.33,38.38 ; U3.86 20.43,45.98 v1(22.52,45.98)
  Bottom Layer w0.152: v1(45.32,41.49) 45.32,42.78 42.13,45.98 v1(22.52,45.98)
ROM_A17: length 53.2
  Top Layer w0.152: 45.33,18.64 45.33,20.4 v1(45.34,20.4) ; U3.89 v1(21.83,47.47)
  Bottom Layer w0.152: v1(45.34,20.4) 45.34,35.86 46.77,37.29 46.77,43.08 42.38,47.47 v1(21.83,47.47)
ROM_A18: length 32.4
  Top Layer w0.152: v1(37.32,36.51) 37.32,38.37 37.33,38.38 ; v1(16.72,41.18) U3.71
  Bottom Layer w0.152: v1(16.72,41.18) 16.72,37.56 17.82,36.47 28.06,36.47 31.76,40.17 35.26,40.17 37.32,38.1 v1(37.32,36.51)
ROM_A19: length 30.1
  Top Layer w0.152: v1(17.23,40.62) 17.23,39.28 U3.72 ; v1(37.83,37.06) 37.83,38.38 37.83,38.38
  Bottom Layer w0.152: v1(37.83,37.06) 37.83,38.17 35.42,40.57 31.59,40.57 27.89,36.87 18.17,36.87 17.23,37.81 v1(17.23,40.62)
ROM_A20: length 24.8
  Top Layer w0.152: v1(41.32,41.49) 41.33,41.48 41.33,38.38 ; v1(21.75,40.98) 20.43,40.98 U3.76
  Bottom Layer w0.152: v1(21.75,40.98) 23.1,40.98 24.32,42.2 40.61,42.2 v1(41.32,41.49)
ROM_A21: length 31.3
  Top Layer w0.152: v1(40.82,40.83) 40.83,40.82 40.83,38.38 ; 18.72,41.18 U3.75
  Bottom Layer w0.152: v1(40.82,40.83) 39.86,41.79 31.08,41.79 27.38,38.09 19.09,38.09 18.73,38.46 v1(18.73,41.18)
ROM_A22: length 30.6
  Top Layer w0.152: v1(39.32,40.17) 39.33,40.15 39.33,38.38 ; U3.73 17.72,41.18 v1(17.72,41.18)
  Bottom Layer w0.152: v1(17.72,41.18) 17.72,38.02 18.47,37.28 27.72,37.28 31.42,40.98 38.51,40.98 v1(39.32,40.17)
ROM_CS: length 48.6
  Top Layer w0.152: 34.33,18.64 34.33,25.17 v1(34.33,25.18) ; U3.47 v1(6.34,42.47)
  Bottom Layer w0.152: v1(6.34,42.47) 7.69,42.47 7.96,42.2 7.96,40.22 6.77,39.02 6.77,35.52 14.16,28.13 17.16,28.13 20.1,25.18 v1(34.33,25.18)
RST: length 55.6
  Top Layer w0.152: v1(18.22,40.62) 18.22,40.62 U3.74 ; U10.1 45.18,17.03 46.01,17.86 46.01,24.98 41.84,29.14 v1(41.16,29.14)
  Bottom Layer w0.152: v1(18.22,40.62) 18.22,38.24 18.77,37.68 27.55,37.68 31.25,41.39 39.46,41.39 41.16,39.69 v1(41.16,29.14)
RST_EXT: length 3.4
  Top Layer w0.152: 45.22,9.79 45.67,6.38
TCK: length 5.6
  Top Layer w0.152: U3.24 7.22,53.5 v1(7.2,53.48)
  Bottom Layer w0.152: XP1.5 7.2,57.44 v1(7.2,53.48)
TDI: length 6
  Top Layer w0.152: XP1.3 4.35,56.73 4.66,56.42 7.2,56.42 7.72,55.9 U3.23
TDO: length 6.2
  Top Layer w0.152: U3.25 6.72,55.68 6.39,56.02 3.54,56.02 3.08,56.47 XP1.2
TMS: length 8.6
  Top Layer w0.152: U3.22 v1(8.22,53.37)
  Bottom Layer w0.152: v1(8.22,53.37) 7.67,52.82 6.39,52.82 5.62,53.58 XP1.4
VMIX: length 15
  Top Layer w0.254: v1(10.25,27.42) 10.25,29.55 9.7,30.1 U2.8
  Top Layer w0.508: D1.1 5.7,23.17 5.61,23.25 7.55,23.25 v1(7.61,23.3)
  Bottom Layer w0.254: v1(10.25,27.42) 8.42,27.42 7.61,26.6 v1(7.61,23.3)
WR: length 79.8
  Top Layer w0.152: v1(6.64,46.47) 5.04,46.47 5.03,46.48 ; U2.5 7.88,31.58 4.65,31.58 v1(4.59,31.63) 4.59,32.28 6.54,34.22 39.66,34.22 40.33,34.9 40.33,38.38 ; U7.8 v1(6.69,18.88)
  Bottom Layer w0.152: v1(6.64,46.47) 5.73,46.47 3.13,43.87 3.13,33.09 v1(4.59,31.63) 6.48,29.74 6.48,19.09 v1(6.69,18.88)
WR_EXT: length 3.9
  Top Layer w0.152: 5.14,6.01 6.68,9.55

## Copper pours and planes (outline as drawn; the poured copper is in the pictures)
GND on Top Layer: -1.23,60.64 52.31,60.64 52.31,-1.54 -1.23,-1.54
GND on Bottom Layer: -1.23,60.64 52.31,60.64 52.31,-1.54 -1.23,-1.54
BAT+ on Bottom Layer: 44.7,52.47 46.93,52.47 46.93,47.18 44.7,47.18
BAT+ on Bottom Layer: 23,53.19 25.23,53.19 25.23,47.91 23,47.91

Small or netless copper shapes (teardrops, artwork), in the pictures only: 500 on Top Layer, 162 on Bottom Layer

## Text on the board
Top Silkscreen Layer: TDO | TDI | TMS | TCK | GND | VCC | TXS0108EPWR | MX29LV640ETTI-70G | Plus v1.1 | Designed by mori | ChisFlash-MBC5
